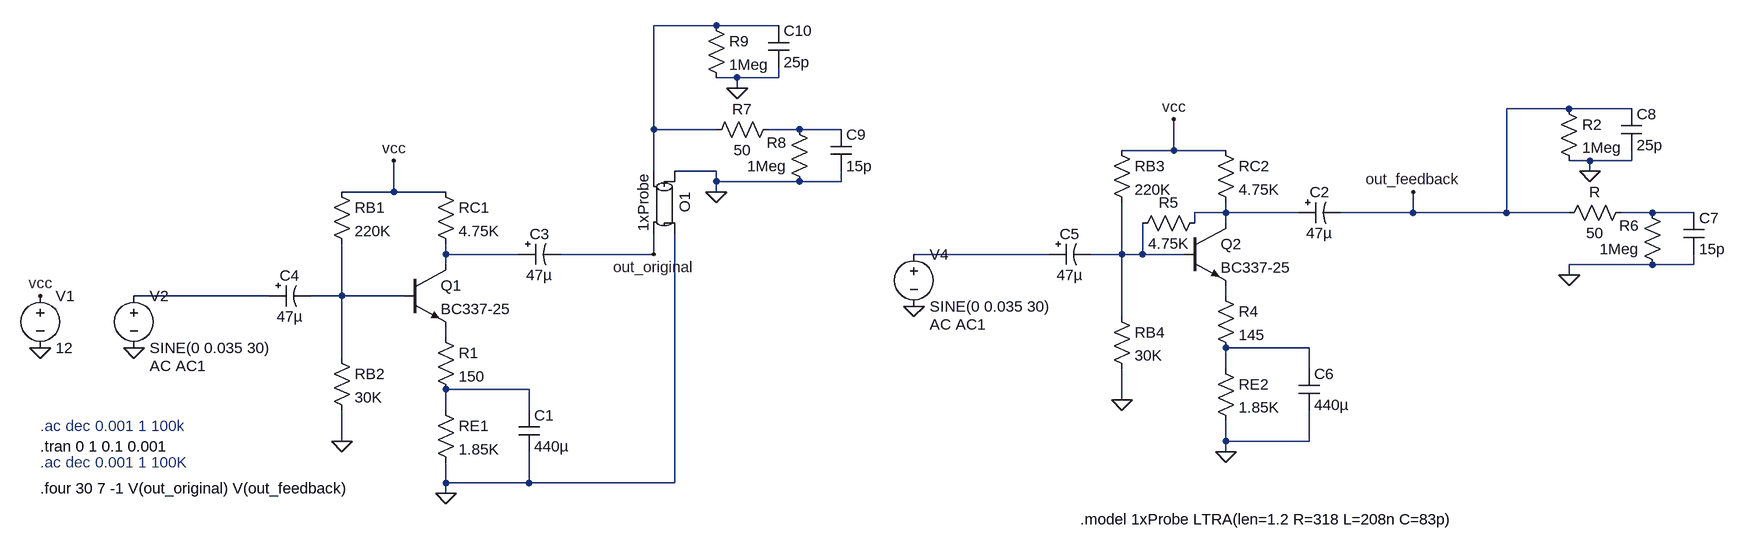
[diagram p0: schematic AmpBJT.asc]
AmpBJT.asc, the LTspice schematic file:
Version 4
SHEET 1 2968 680
WIRE 640 -288 544 -288
WIRE 736 -288 640 -288
WIRE 672 -208 640 -208
WIRE 736 -208 736 -224
WIRE 736 -208 672 -208
WIRE 672 -192 672 -208
WIRE 1952 -160 1856 -160
WIRE 2048 -160 1952 -160
WIRE 544 -128 544 -288
WIRE 640 -128 544 -128
WIRE 768 -128 720 -128
WIRE 832 -128 768 -128
WIRE 1344 -96 1344 -144
WIRE 1344 -96 1264 -96
WIRE 1424 -96 1344 -96
WIRE 1984 -80 1952 -80
WIRE 2048 -80 2048 -96
WIRE 2048 -80 1984 -80
WIRE 544 -64 544 -128
WIRE 640 -64 576 -64
WIRE 1984 -64 1984 -80
WIRE 640 -48 640 -64
WIRE 768 -48 640 -48
WIRE 832 -48 832 -64
WIRE 832 -48 768 -48
WIRE 144 -32 144 -80
WIRE 144 -32 64 -32
WIRE 224 -32 144 -32
WIRE 640 -32 640 -48
WIRE 1424 0 1424 -16
WIRE 1424 0 1376 0
WIRE 1536 0 1424 0
WIRE 1712 0 1712 -32
WIRE 1712 0 1600 0
WIRE 1856 0 1856 -160
WIRE 1856 0 1712 0
WIRE 1952 0 1856 0
WIRE 2080 0 2032 0
WIRE 2144 0 2080 0
WIRE 1376 16 1376 0
WIRE 1424 16 1424 0
WIRE 224 64 224 48
WIRE 336 64 224 64
WIRE 544 64 544 32
WIRE 544 64 400 64
WIRE 1152 64 944 64
WIRE 1264 64 1264 -16
WIRE 1264 64 1216 64
WIRE 1296 64 1296 16
WIRE 1296 64 1264 64
WIRE 1360 64 1296 64
WIRE 224 80 224 64
WIRE 2080 80 1952 80
WIRE 2144 80 2144 64
WIRE 2144 80 2080 80
WIRE 1952 96 1952 80
WIRE -48 128 -256 128
WIRE 64 128 64 48
WIRE 64 128 16 128
WIRE 160 128 64 128
WIRE 1424 128 1424 112
WIRE 1264 160 1264 64
WIRE 224 192 224 176
WIRE 1552 208 1424 208
WIRE 64 224 64 128
WIRE 1424 240 1424 208
WIRE 1552 240 1552 208
WIRE 352 272 224 272
WIRE 1264 288 1264 240
WIRE 224 304 224 272
WIRE 352 304 352 272
WIRE 64 352 64 304
WIRE 1424 352 1424 320
WIRE 1552 352 1552 304
WIRE 1552 352 1424 352
WIRE 1424 368 1424 352
WIRE 224 416 224 384
WIRE 352 416 352 368
WIRE 352 416 224 416
WIRE 576 416 576 32
WIRE 576 416 352 416
WIRE 224 432 224 416
FLAG 144 -80 vcc
FLAG 224 432 0
FLAG 64 352 0
FLAG -400 128 vcc
FLAG -400 208 0
FLAG -256 208 0
FLAG 544 64 out_original
FLAG 1344 -144 vcc
FLAG 1424 368 0
FLAG 1264 288 0
FLAG 944 144 0
FLAG 1712 -32 out_feedback
FLAG 1952 96 0
FLAG 1984 -64 0
FLAG 640 -32 0
FLAG 672 -192 0
SYMBOL res 48 -48 R0
SYMATTR InstName RB1
SYMATTR Value 220K
SYMBOL res 208 -48 R0
SYMATTR InstName RC1
SYMATTR Value 4.75K
SYMBOL res 208 288 R0
SYMATTR InstName RE1
SYMATTR Value 1.85K
SYMBOL res 48 208 R0
SYMATTR InstName RB2
SYMATTR Value 30K
SYMBOL polcap 336 48 M90
WINDOW 0 0 32 VBottom 2
WINDOW 3 32 32 VTop 2
SYMATTR InstName C3
SYMATTR Value 47µ
SYMBOL polcap -48 112 M90
WINDOW 0 0 32 VBottom 2
WINDOW 3 32 32 VTop 2
SYMATTR InstName C4
SYMATTR Value 47µ
SYMBOL voltage -400 112 R0
WINDOW 123 0 0 Left 0
WINDOW 39 0 0 Left 0
SYMATTR InstName V1
SYMATTR Value 12
SYMBOL voltage -256 112 R0
WINDOW 123 24 124 Left 2
WINDOW 39 0 0 Left 0
SYMATTR Value2 AC AC1
SYMATTR InstName V2
SYMATTR Value SINE(0 0.035 30)
SYMBOL npn 160 80 R0
SYMATTR InstName Q1
SYMATTR Value BC337-25
SYMBOL cap 336 304 R0
SYMATTR InstName C1
SYMATTR Value 440µ
SYMBOL res 208 176 R0
SYMATTR InstName R1
SYMATTR Value 150
SYMBOL res 1248 -112 R0
SYMATTR InstName RB3
SYMATTR Value 220K
SYMBOL res 1408 -112 R0
SYMATTR InstName RC2
SYMATTR Value 4.75K
SYMBOL res 1408 224 R0
SYMATTR InstName RE2
SYMATTR Value 1.85K
SYMBOL res 1248 144 R0
SYMATTR InstName RB4
SYMATTR Value 30K
SYMBOL polcap 1536 -16 M90
WINDOW 0 0 32 VBottom 2
WINDOW 3 32 32 VTop 2
SYMATTR InstName C2
SYMATTR Value 47µ
SYMBOL polcap 1152 48 M90
WINDOW 0 0 32 VBottom 2
WINDOW 3 32 32 VTop 2
SYMATTR InstName C5
SYMATTR Value 47µ
SYMBOL voltage 944 48 R0
WINDOW 123 24 124 Left 2
WINDOW 39 0 0 Left 0
SYMATTR Value2 AC AC1
SYMATTR InstName V4
SYMATTR Value SINE(0 0.035 30)
SYMBOL npn 1360 16 R0
SYMATTR InstName Q2
SYMATTR Value BC337-25
SYMBOL cap 1536 240 R0
SYMATTR InstName C6
SYMATTR Value 440µ
SYMBOL res 1408 112 R0
SYMATTR InstName R4
SYMATTR Value 145
SYMBOL res 1392 0 R90
WINDOW 0 0 56 VBottom 2
WINDOW 3 32 56 VTop 2
SYMATTR InstName R5
SYMATTR Value 4.75K
SYMBOL res 2048 -16 R90
WINDOW 0 0 56 VBottom 2
WINDOW 3 32 56 VTop 2
SYMATTR InstName R
SYMATTR Value 50
SYMBOL res 2096 96 R180
WINDOW 0 36 76 Left 2
WINDOW 3 36 40 Left 2
SYMATTR InstName R6
SYMATTR Value 1Meg
SYMBOL cap 2128 0 R0
SYMATTR InstName C7
SYMATTR Value 15p
SYMBOL res 1936 -176 R0
SYMATTR InstName R2
SYMATTR Value 1Meg
SYMBOL cap 2032 -160 R0
SYMATTR InstName C8
SYMATTR Value 25p
SYMBOL res 736 -144 R90
WINDOW 0 0 56 VBottom 2
WINDOW 3 32 56 VTop 2
SYMATTR InstName R7
SYMATTR Value 50
SYMBOL res 784 -32 R180
WINDOW 0 36 76 Left 2
WINDOW 3 36 40 Left 2
SYMATTR InstName R8
SYMATTR Value 1Meg
SYMBOL cap 816 -128 R0
SYMATTR InstName C9
SYMATTR Value 15p
SYMBOL res 624 -304 R0
SYMATTR InstName R9
SYMATTR Value 1Meg
SYMBOL cap 720 -288 R0
SYMATTR InstName C10
SYMATTR Value 25p
SYMBOL ltline 560 -16 R90
SYMATTR InstName O1
SYMATTR Value 1xProbe
TEXT -400 384 Left 2 ;.ac dec 0.001 1 100K
TEXT -400 328 Left 2 ;.ac dec 0.001 1 100k
TEXT -400 360 Left 2 !.tran 0 1 0.1 0.001
TEXT -400 424 Left 2 !.four 30 7 -1 V(out_original) V(out_feedback)
TEXT 1200 472 Left 2 !.model 1xProbe LTRA(len=1.2 R=318 L=208n C=83p)

The netlist it stands for:
* AmpBJT.asc
RB1 vcc N009 220K
RC1 vcc N005 4.75K
RE1 N013 0 1.85K
RB2 N009 0 30K
C3 N005 out_original 47µ
C4 N008 N009 47µ
V1 vcc 0 12
V2 N008 0 SINE(0 0.035 30) AC AC1
Q1 N005 N009 N011 0 BC337-25
C1 N013 0 440µ
R1 N011 N013 150
RB3 vcc N007 220K
RC2 vcc N003 4.75K
RE2 N012 0 1.85K
RB4 N007 0 30K
C2 N003 out_feedback 47µ
C5 N006 N007 47µ
V4 N006 0 SINE(0 0.035 30) AC AC1
Q2 N003 N007 N010 0 BC337-25
C6 N012 0 440µ
R4 N010 N012 145
R5 N003 N007 4.75K
R N004 out_feedback 50
R6 0 N004 1Meg
C7 N004 0 15p
R2 out_feedback 0 1Meg
C8 out_feedback 0 25p
R7 N002 N001 50
R8 0 N002 1Meg
C9 N002 0 15p
R9 N001 0 1Meg
C10 N001 0 25p
O1 0 N001 0 out_original 1xProbe
.model NPN NPN
.model PNP PNP
.lib standard.bjt
* .ac dec 0.001 1 100K
* .ac dec 0.001 1 100k
.tran 0 1 0.1 0.001
.four 30 7 -1 V(out_original) V(out_feedback)
.model 1xProbe LTRA(len=1.2 R=318 L=208n C=83p)
.backanno
.end